# EasyEDA schematic SCH_GSME_voltmeter_Arduino_ESP8266_TP4056_2023-03-22.json
TITLE: Watch-i-metro; REV: 1.4; Date: 2023-03-22; Sheet: 1/1; Drawn By: Rubén Mellado C.; Company: Colegio Juan Comenius
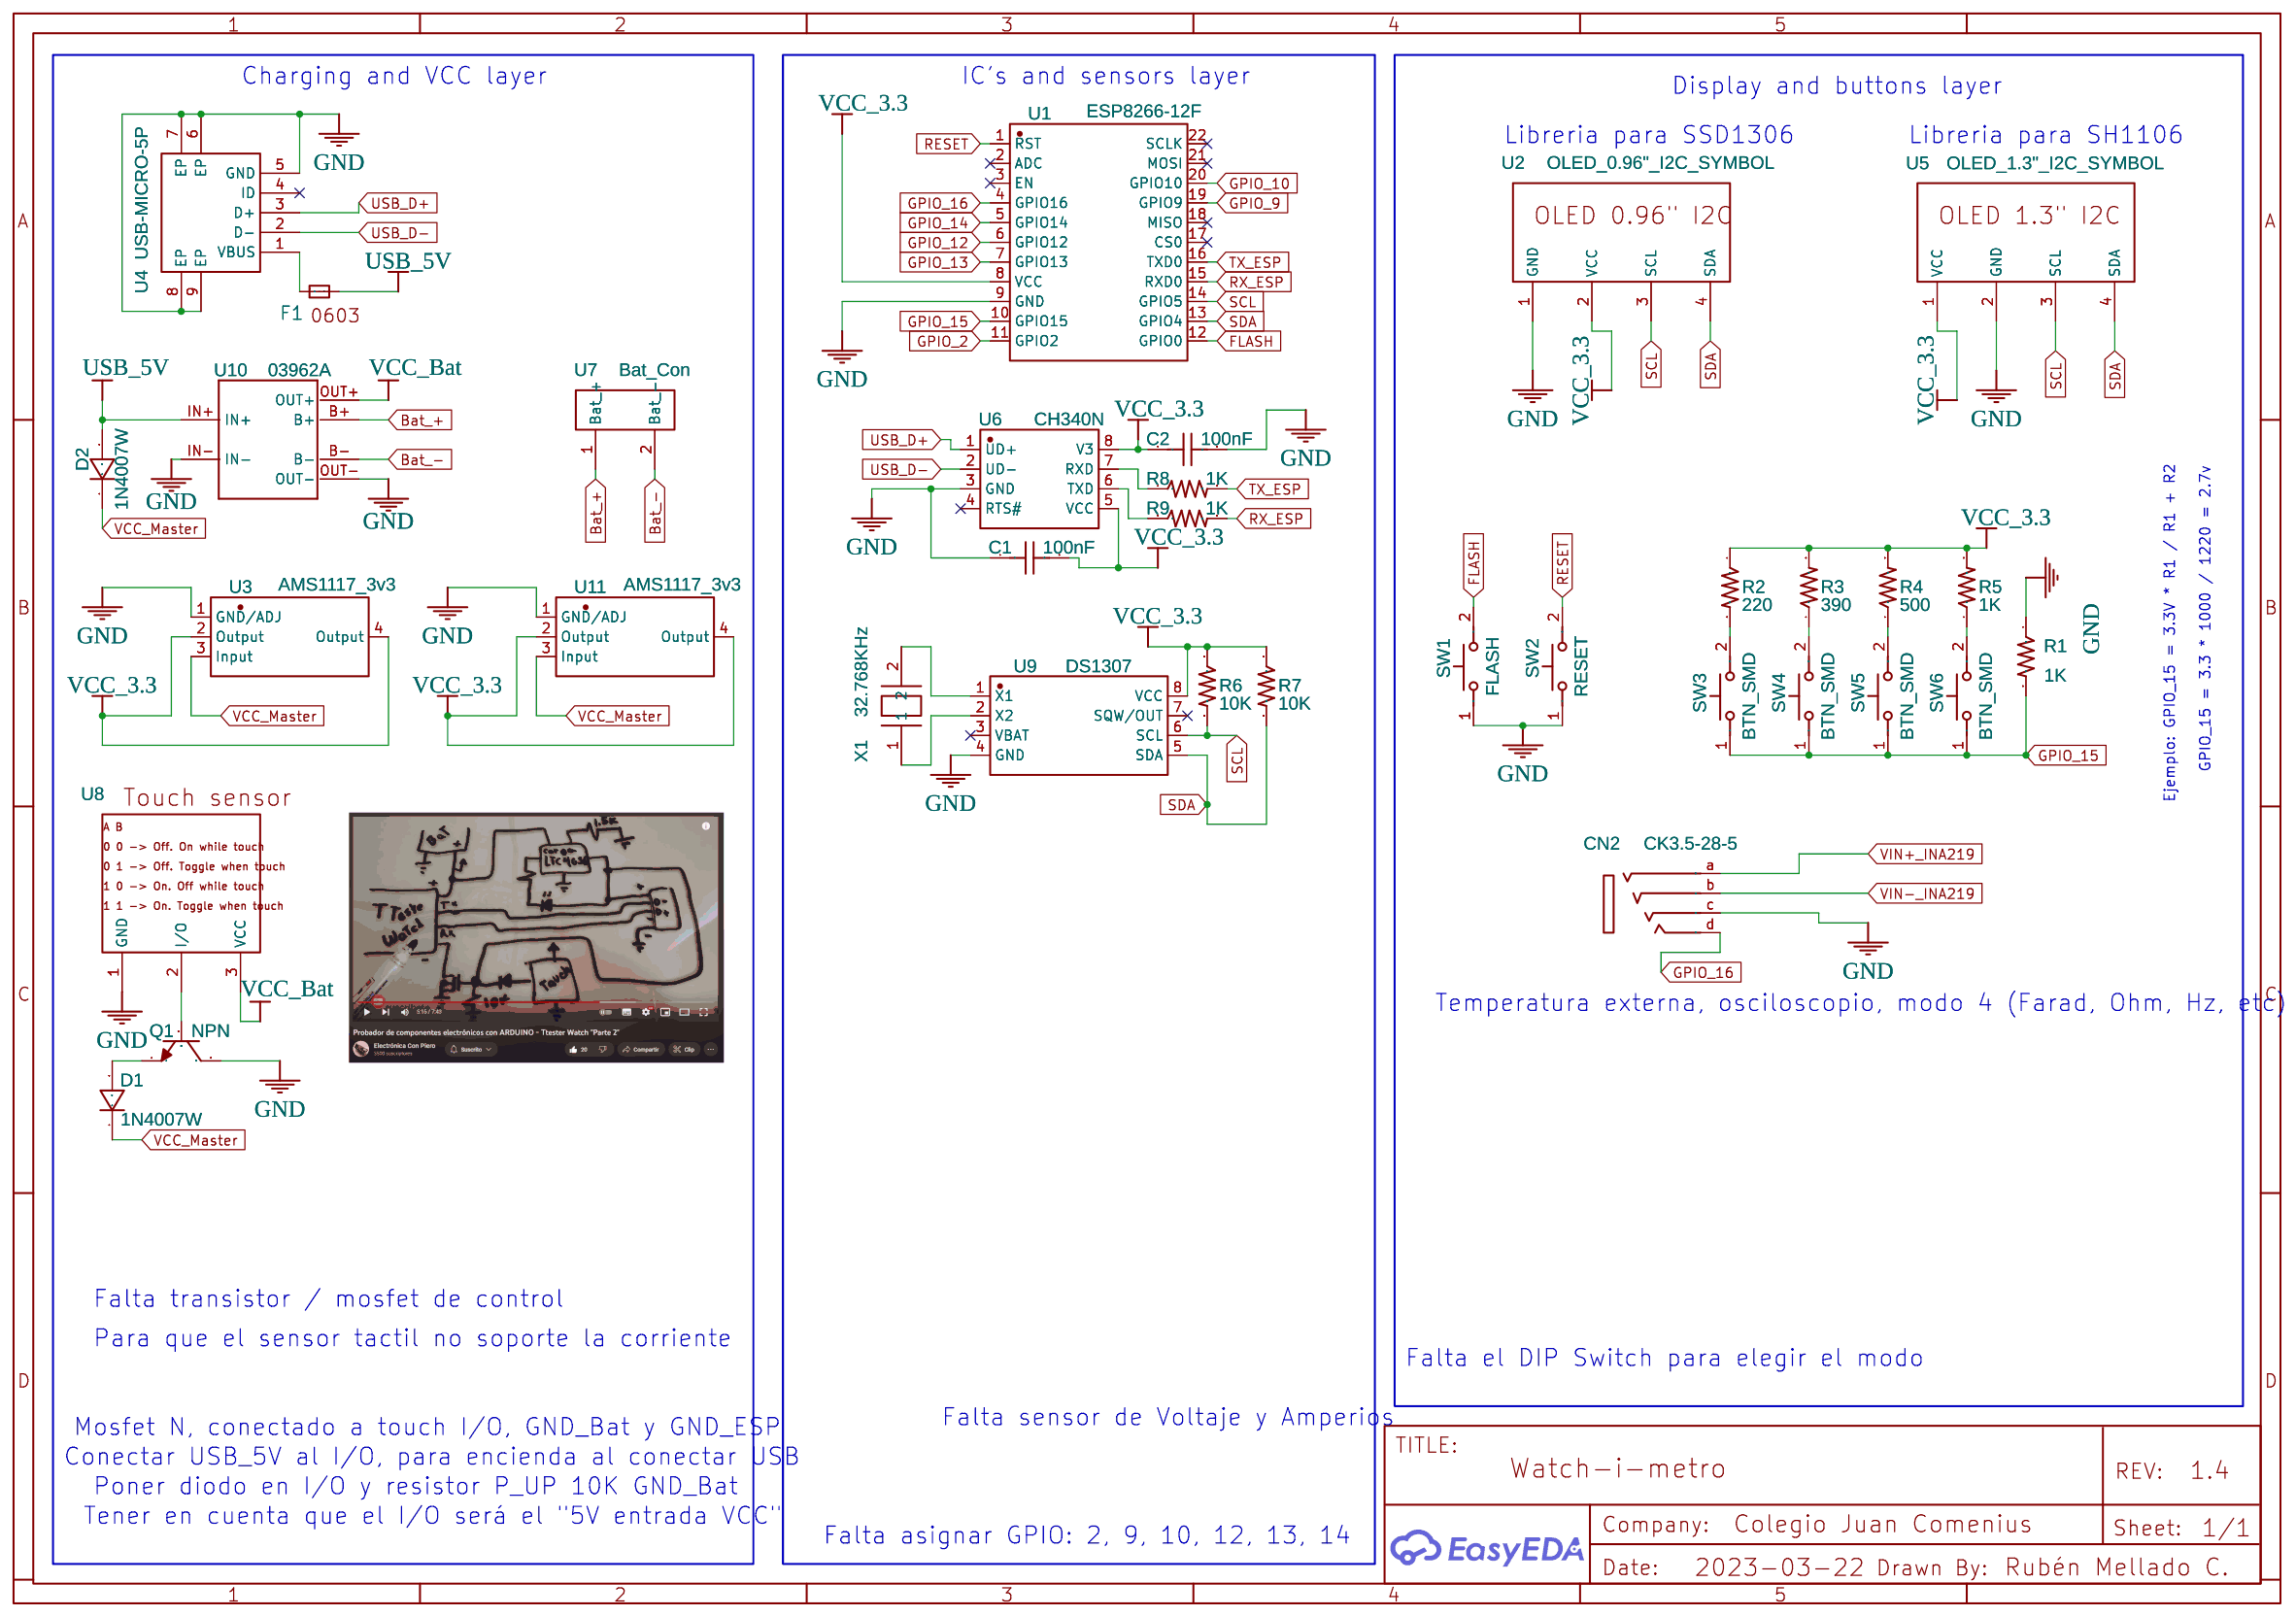
[diagram p0: schematic sheet]

## Parts
C1  100nF  [C0603]
C2  100nF  [C0603]
CN2  CK3.5-28-5  [AUDIO-TH_CK3.5-28-5]
D1  1N4007W  [SOD-123_L2.8-W1.8-LS3.7-RD]
D2  1N4007W  [SOD-123_L2.8-W1.8-LS3.7-RD]
F1  Fuse  [0603-FUSE_FOOTPRINT]
Q1  NPN  [SOT-23-3_L2.9-W1.3-P1.83-LS2.4-BR-1]
R1  1K  [0603-RES]
R2  220  [0603-RES]
R3  390  [0603-RES]
R4  500  [0603-RES]
R5  1K  [0603-RES]
R6  10K  [0603-RES]
R7  10K  [0603-RES]
R8  1K  [0603-RES]
R9  1K  [0603-RES]
SW1  FLASH  [SW-SMD_L6.0-W3.5-LS8.0-1]
SW2  RESET  [SW-SMD_L6.0-W3.5-LS8.0-1]
SW3  BTN_SMD  [SW-SMD_L6.0-W3.5-LS8.0-1]
SW4  BTN_SMD  [SW-SMD_L6.0-W3.5-LS8.0-1]
SW5  BTN_SMD  [SW-SMD_L6.0-W3.5-LS8.0-1]
SW6  BTN_SMD  [SW-SMD_L6.0-W3.5-LS8.0-1]
U1  ESP8266-12F  [WIFIM-SMD_ESP-12F-ESP8266MOD]
U2  OLED_0.96"_I2C_SYMBOL  [OLED_0.96"_I2C_FOOTPRINT]
U3  AMS1117_3v3  [SOT-223-4_L6.5-W3.5-P2.30-LS7.0-BL]
U4  USB-MICRO-5P  [MICRO-USB-SMD_MICRO-USB-A9]
U5  OLED_1.3"_I2C_SYMBOL  [OLED_1.3"_I2C_FOOTPRINT]
U6  CH340N  [SOP-8_L5.0-W4.0-P1.27-LS6.0-BL]
U7  Bat_Con  [CONNECTOR_BATTERY_2_WIRES_2P_FOOTPRINT]
U8  Touch_Sensor  [TOUCH_SENSOR_3P_A_B_FOOTPRINT]
U9  DS1307  [SOP-8_L4.9-W3.9-P1.27-LS6.0-BL]
U10  03962A  [03962A_THT_TP4056_FOOTPRINT]
U11  AMS1117_3v3  [SOT-223-4_L6.5-W3.5-P2.30-LS7.0-BL]
X1  32.768KHz  [QUARTZ_X_2P_FOOTPRINT]

## Library data of the parts
C1 C2 = C_0603_US: Contributor: LCEDA_Lib
CN2 = CK3.5-28-5: Supplier: LCSC; Supplier Part: C718048; Manufacturer: JINJIA; Contributor: LCSC; JLCPCB Part Class: Extended Part
D1 D2 = 1N4007W: Supplier: LCSC; Supplier Part: C328592; Manufacturer: BLUE ROCKET; Contributor: LCEDA_Lib
F1 = 0603_FUSE_SYMBOL: Supplier: LCSC; Supplier Part: C9900014602; Manufacturer: null; Manufacturer Part: 0603; Contributor: lcsc; Convert to PCB: Yes; Add into BOM: Yes; JLCPCB Part Class: Extended Part; Package Display: No
Q1 = 2N3904(SOT-23): Supplier: LCSC; Manufacturer: KEC; Manufacturer Part: 2n3904S-RTK/PS; Supplier Part: C18536; Paste Type: SOT-23; Contributor: LCEDA_Lib; Package Display: No
R1-R9 = RESISTOR0603: Resistor; Contributor: SparkFun
SW1-SW6 = BUTTON2: Supplier: LCSC; Supplier Part: C9900005988; Manufacturer: null; JLCPCB Part Class: Extended Part; Contributor: LCSC
U1 = ESP-12F(ESP8266MOD): Supplier: LCSC; Manufacturer: Ai-Thinker(安信可); Supplier Part: C82891; JLCPCB Part Class: Extended Part
U2 = OLED_0.96"_I2C_SYMBOL: Contributor: Teycot YT; Package Display: No
U3 U11 = AMS1117-3.3S: Supplier: LCSC; Supplier Part: C2842296; Manufacturer: KEXIN(科信); link: https://atta.szlcsc.com//upload/public/pdf/source/20220119/687E7B65F4F54F278E2F75AE3BEEDBF9.pdf; Contributor: LCSC; JLCPCB Part Class: Extended Part
U4 = USB-MICRO-5P: Supplier: LCSC; Supplier Part: C9900014288; Manufacturer: null; Manufacturer Part: USB-Micro-5P; Contributor: lcsc; JLCPCB Part Class: Extended Part
U5 = OLED_1.3"_I2C_SYMBOL: Contributor: teycotyt; Package Display: No
U6 = CH340N: Supplier: LCSC; Supplier Part: C506813; Manufacturer: WCH(南京沁恒); Contributor: LCSC; JLCPCB Part Class: Extended Part
U7 = Connector_Battery_2_Wires_2p: Contributor: Teycot YT; Package Display: No
U8 = Touch_Sensor_3p_A_B_SYMBOL: Contributor: Teycot YT; Package Display: No
U9 = DS1307M/TR: Supplier: LCSC; Supplier Part: C356706; Manufacturer: HGSEMI(华冠); Contributor: LCSC; JLCPCB Part Class: Extended Part
U10 = 03962A: Contributor: Anselmo Busnadiego; Package Display: No
X1 = Quartz_X_2p_Symbol: Contributor: Teycot YT

## Nets
GND: C1.1 C2.2 CN2.c Q1.2(C) R1.1 SW1.1 SW2.1 U1.9(GND) U2.1(GND) U3.1(GND/ADJ) U4.5(GND) U4.6(EP) U4.7(EP) U4.8(EP) U4.9(EP) U5.2(GND) U6.3(GND) U8.1(GND) U9.4(GND) U10.IN- U10.OUT- U11.1(GND/ADJ)
VCC_3.3: C1.2 C2.1 R2.1 R3.2 R4.2 R5.2 R6.1 R7.1 U1.8(VCC) U2.2(VCC) U3.2(Output) U3.4(Output) U5.1(VCC) U6.5(VCC) U6.8(V3) U9.8(VCC) U11.2(Output) U11.4(Output)
VCC_Bat: U8.3(VCC) U10.OUT+
VCC_Master: D1.1 D2.1 U3.3(Input) U11.3(Input)
VIN+_INA219: CN2.a
VIN-_INA219: CN2.b
Bat_+: U7.1(Bat_+) U10.B+
Bat_-: U7.2(Bat_-) U10.B-
FLASH: SW1.2 U1.12(GPIO0)
GPIO_2: U1.11(GPIO2)
GPIO_9: U1.19(GPIO9)
GPIO_10: U1.20(GPIO10)
GPIO_12: U1.6(GPIO12)
GPIO_13: U1.7(GPIO13)
GPIO_14: U1.5(GPIO14)
GPIO_15: R1.2 SW3.1 SW4.1 SW5.1 SW6.1 U1.10(GPIO15)
GPIO_16: CN2.d U1.4(GPIO16)
RESET: SW2.2 U1.1(RST)
RX_ESP: R9.2 U1.15(RXD0)
SCL: R6.2 U1.14(GPIO5) U2.3(SCL) U5.3(SCL) U9.6(SCL)
SDA: R7.2 U1.13(GPIO4) U2.4(SDA) U5.4(SDA) U9.5(SDA)
TX_ESP: R8.2 U1.16(TXD0)
USB_5V: D2.2 F1.2(A) U10.IN+
USB_D+: U4.3(D+) U6.1(UD+)
USB_D-: U4.2(D-) U6.2(UD-)
Net-(D1-2): D1.2 Q1.1(E)
Net-(F1-1): F1.1(K) U4.1(VBUS)
Net-(Q1-3): Q1.3(B) U8.2(I/O)
Net-(R2-2): R2.2 SW3.2
Net-(R3-1): R3.1 SW4.2
Net-(R4-1): R4.1 SW5.2
Net-(R5-1): R5.1 SW6.2
Net-(R8-1): R8.1 U6.7(RXD)
Net-(R9-1): R9.1 U6.6(TXD)
Net-(U9-1): U9.1(X1) X1.2
Net-(U9-2): U9.2(X2) X1.1

Not connected (* = marked no-connect by the designer): U1 2(ADC)* 3(EN)* 17(CS0)* 18(MISO)* 21(MOSI)* 22(SCLK)*; U4 4(ID)*; U6 4(RTS#)*; U9 3(VBAT)* 7(SQW/OUT)*

## Notes on the sheet
- Charging and VCC layer
- IC's and sensors layer
- Display and buttons layer
- Libreria para SSD1306
- Libreria para SH1106
- GPIO_15 = 3.3 * 1000 / 1220 = 2.7v
- Ejemplo: GPIO_15 = 3.3V * R1 / R1 + R2
- Temperatura externa, osciloscopio, modo 4 (Farad, Ohm, Hz, etc)
- Falta transistor / mosfet de control
- Para que el sensor tactil no soporte la corriente
- Falta el DIP Switch para elegir el modo
- Mosfet N, conectado a touch I/O, GND_Bat y GND_ESP
- Falta sensor de Voltaje y Amperios
- Conectar USB_5V al I/O, para encienda al conectar USB
- Poner diodo en I/O y resistor P_UP 10K GND_Bat
- Tener en cuenta que el I/O será el "5V entrada VCC"
- Falta asignar GPIO: 2, 9, 10, 12, 13, 14
